# Altium schematic sheet Main.SchDoc
size A3
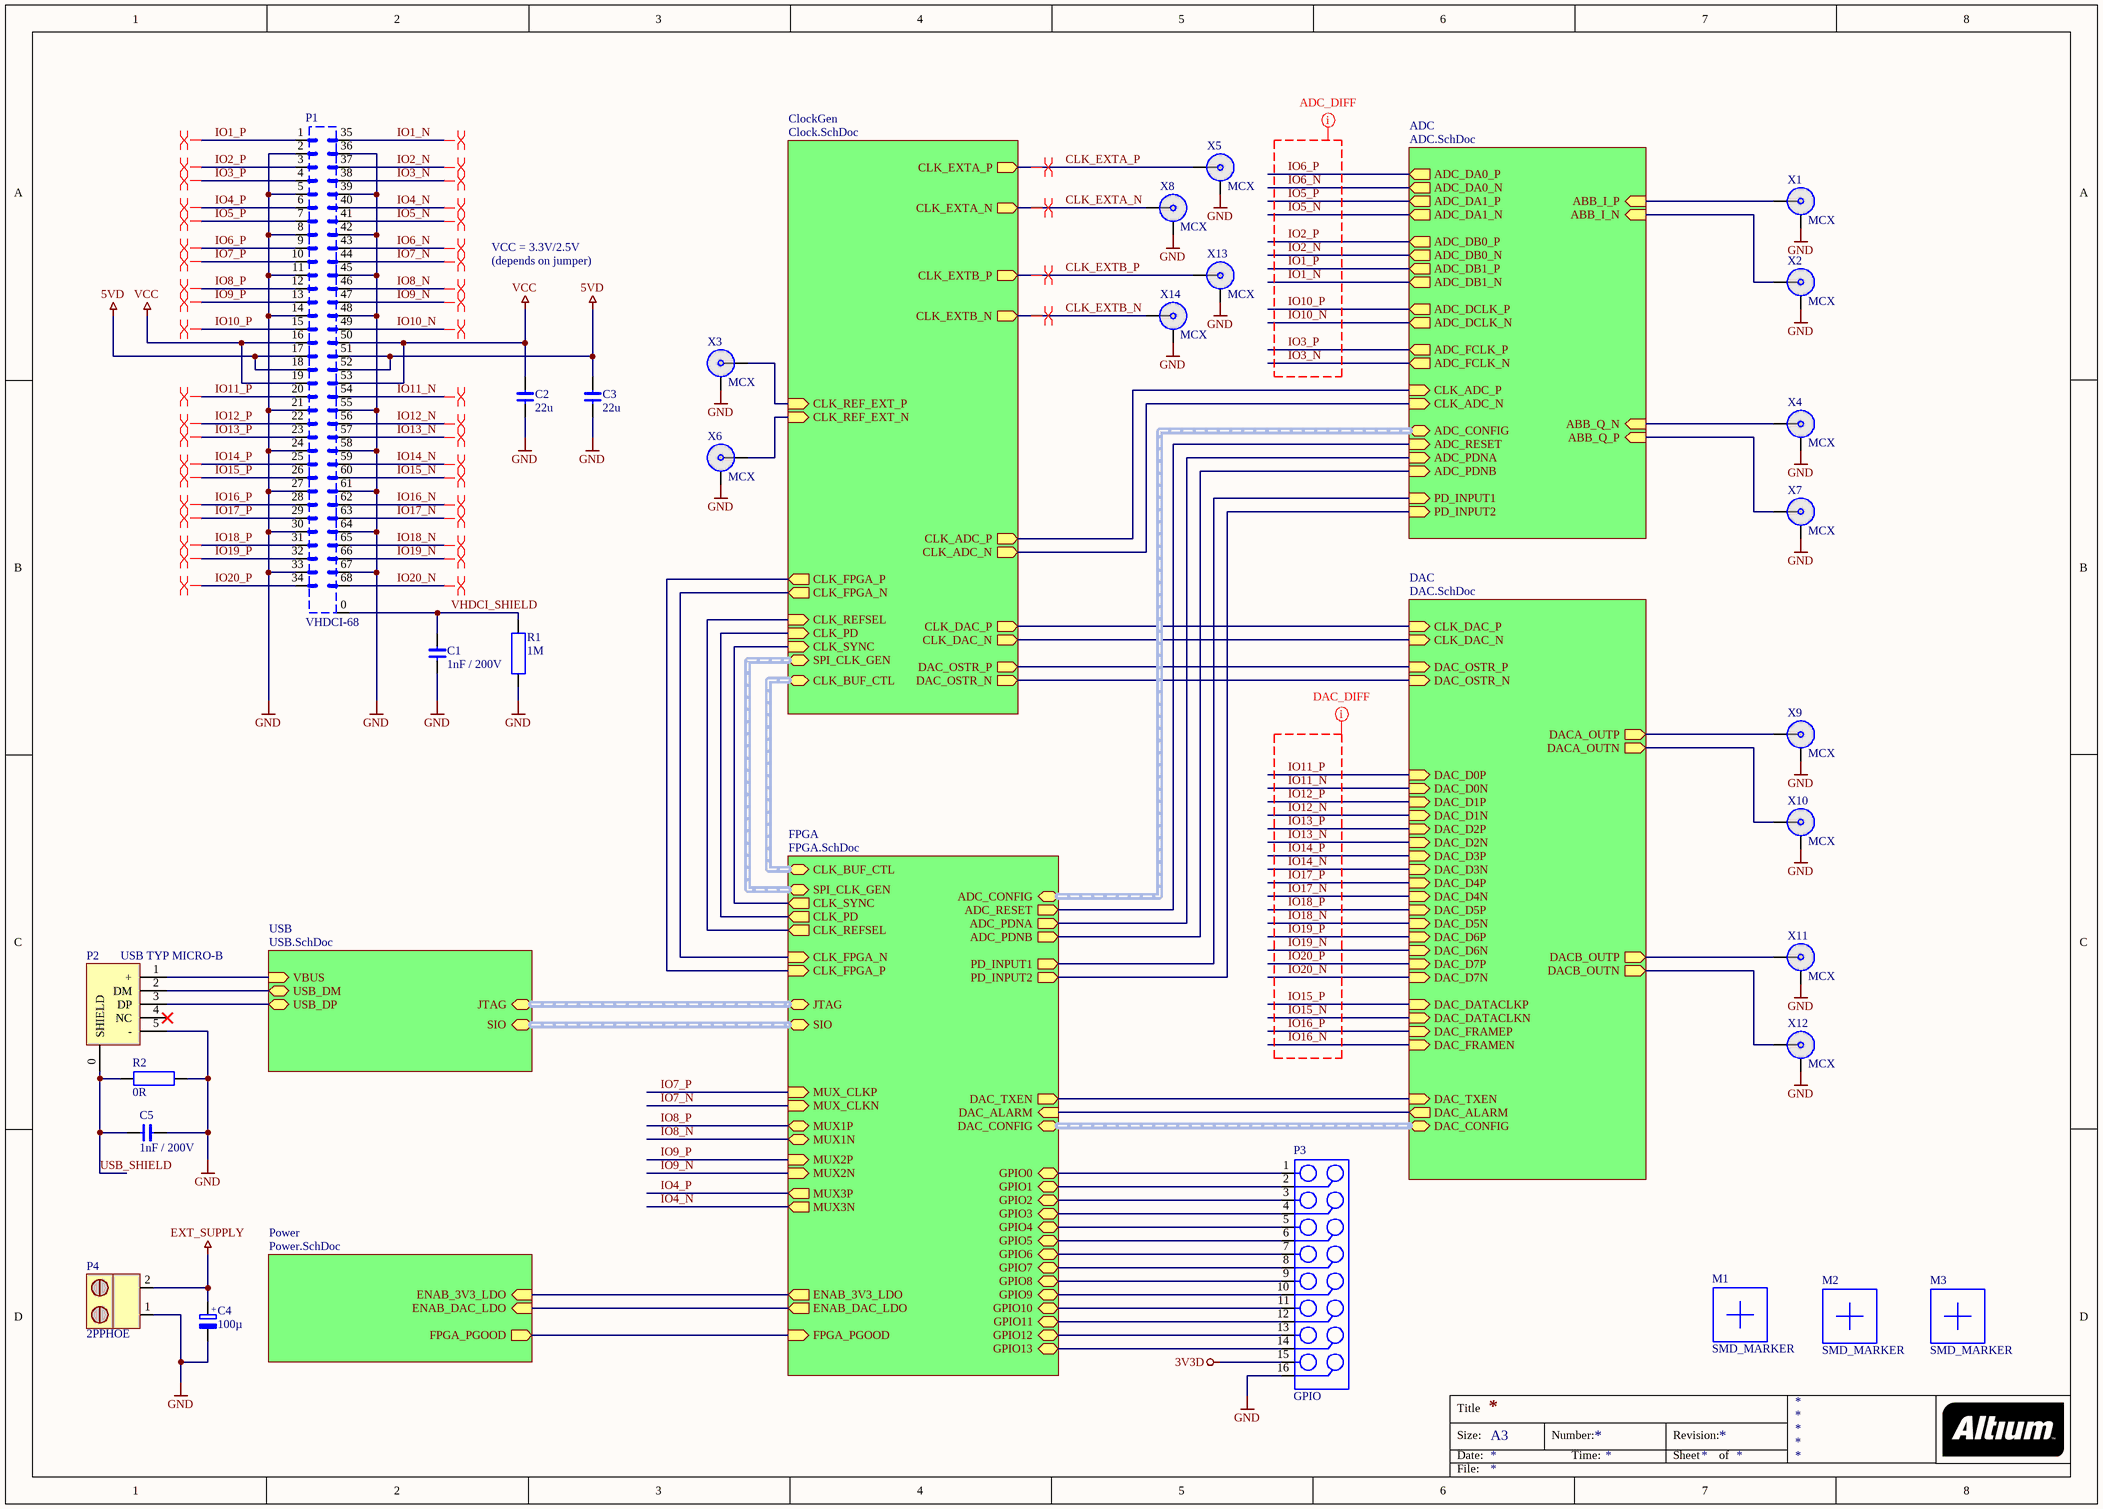
[diagram p0: Main.SchDoc]

## Parts
C1  1nF / 200V  [1206]
C2  22u  [1206]
C3  22u  [1206]
C4  100µ  [SMD_ELKO_6.3]
C5  1nF / 200V  [1206]
M1  SMD_MARKER  [SMDMark100 - nopaste]
M2  SMD_MARKER  [SMDMark100 - nopaste]
M3  SMD_MARKER  [SMDMark100 - nopaste]
P1  VHDCI-68  [VHDCI-68_M]
P2  USB TYP MICRO-B  [USB_MICRO_B_SMD_4DIP]
P3  GPIO  [16POL_PF2]
P4  2PPHOE  [2PPHOE]
R1  1M  [1206]
R2  0R  [1206]
X1  MCX  [MCX_TH]
X2  MCX  [MCX_TH]
X3  MCX  [MCX_TH]
X4  MCX  [MCX_TH]
X5  MCX  [MCX_TH]
X6  MCX  [MCX_TH]
X7  MCX  [MCX_TH]
X8  MCX  [MCX_TH]
X9  MCX  [MCX_TH]
X10  MCX  [MCX_TH]
X11  MCX  [MCX_TH]
X12  MCX  [MCX_TH]
X13  MCX  [MCX_TH]
X14  MCX  [MCX_TH]

## Sub-sheets
ADC = ADC.SchDoc: ABB_I_P (in), ABB_I_N (in), ABB_Q_N (in), ABB_Q_P (in), CLK_ADC_P (in), CLK_ADC_N (in), ADC_DA0_P (out), ADC_DA1_P (out), ADC_DB0_P (out), ADC_DB1_P (out), ADC_DCLK_P (out), ADC_FCLK_P (out), ADC_CONFIG (harness SPI3), ADC_RESET (in), ADC_PDNA (in), ADC_PDNB (in), PD_INPUT1 (in), PD_INPUT2 (in), ADC_DA0_N (out), ADC_DA1_N (out), ADC_DB0_N (out), ADC_DB1_N (out), ADC_DCLK_N (out), ADC_FCLK_N (out)
ClockGen = Clock.SchDoc: SPI_CLK_GEN (harness SPI_CLK_GEN), CLK_REFSEL (in), CLK_PD (in), CLK_SYNC (in), CLK_REF_EXT_P (in), CLK_REF_EXT_N (in), CLK_ADC_P (out), CLK_ADC_N (out), CLK_DAC_P (out), CLK_DAC_N (out), DAC_OSTR_P (out), DAC_OSTR_N (out), CLK_FPGA_P (out), CLK_FPGA_N (out), CLK_EXTB_P (out), CLK_EXTB_N (out), CLK_EXTA_P (out), CLK_EXTA_N (out), CLK_BUF_CTL (harness CLK_BUF_CTL)
DAC = DAC.SchDoc: DAC_D0P (in), DAC_D0N (in), DAC_D1P (in), DAC_D1N (in), DAC_D2P (in), DAC_D2N (in), DAC_D3P (in), DAC_D3N (in), DAC_D4P (in), DAC_D4N (in), DAC_D5P (in), DAC_D5N (in), DAC_D6N (in), DAC_D7N (in), DAC_D6P (in), DAC_D7P (in), DAC_DATACLKN (in), DAC_DATACLKP (in), DAC_FRAMEN (in), DAC_FRAMEP (in), DAC_CONFIG (harness SPI3), DAC_TXEN (in), DAC_ALARM (out), DACA_OUTP (out), DACA_OUTN (out), DACB_OUTP (out), DACB_OUTN (out), CLK_DAC_P (in), CLK_DAC_N (in), DAC_OSTR_P (in), DAC_OSTR_N (in)
FPGA = FPGA.SchDoc: JTAG (harness JTAG), SIO (harness Serial IO), ENAB_3V3_LDO (out), FPGA_PGOOD (in), DAC_CONFIG (harness SPI3), DAC_TXEN (out), DAC_ALARM (in), ADC_CONFIG (harness SPI3), ADC_RESET (out), ADC_PDNA (out), ADC_PDNB (out), MUX_CLKP (in), MUX_CLKN (in), MUX2P (in), MUX2N (in), MUX3N (out), MUX3P (out), GPIO0, GPIO1, GPIO2, GPIO3, GPIO4, GPIO5, GPIO6, GPIO7, GPIO8, GPIO9, GPIO10, GPIO11, GPIO12, GPIO13, PD_INPUT1 (out), PD_INPUT2 (out), SPI_CLK_GEN (harness SPI_CLK_GEN), CLK_REFSEL (out), CLK_PD (out), CLK_SYNC (out), CLK_FPGA_P (in), CLK_FPGA_N (in), ENAB_DAC_LDO (out), MUX1N, MUX1P, CLK_BUF_CTL (harness CLK_BUF_CTL)
Power = Power.SchDoc: ENAB_3V3_LDO (in), FPGA_PGOOD (out), ENAB_DAC_LDO (in)
USB = USB.SchDoc: USB_DP (bidir), USB_DM (bidir), JTAG (harness JTAG), SIO (harness Serial IO), VBUS (in)

## Nets
3V3D: P3.15
5VD: C3.1 P1.17 P1.18 P1.51 P1.52
EXT_SUPPLY: C4.1(+) P4.2
GND: C1.2 C2.2 C3.2 C4.2(-) C5.1 P1.2 P1.5 P1.8 P1.11 P1.14 P1.21 P1.24 P1.27 P1.30 P1.33 P1.36 P1.39 P1.42 P1.45 P1.48 P1.55 P1.58 P1.61 P1.64 P1.67 P2.5(-) P3.16 P4.1 R1.2 R2.1 X1.1 X2.1 X3.1 X4.1 X5.1 X6.1 X7.1 X8.1 X9.1 X10.1 X11.1 X12.1 X13.1 X14.1
VCC: C2.1 P1.16 P1.19 P1.50 P1.53
CLK_EXTA_N: X8.2 ; sheet ClockGen/CLK_EXTA_N
CLK_EXTA_P: X5.2 ; sheet ClockGen/CLK_EXTA_P
CLK_EXTB_N: X14.2 ; sheet ClockGen/CLK_EXTB_N
CLK_EXTB_P: X13.2 ; sheet ClockGen/CLK_EXTB_P
IO1_N: P1.35 ; sheet ADC/ADC_DB1_N
IO1_P: P1.1 ; sheet ADC/ADC_DB1_P
IO2_N: P1.37 ; sheet ADC/ADC_DB0_N
IO2_P: P1.3 ; sheet ADC/ADC_DB0_P
IO3_N: P1.38 ; sheet ADC/ADC_FCLK_N
IO3_P: P1.4 ; sheet ADC/ADC_FCLK_P
IO4_N: P1.40 ; sheet FPGA/MUX3N
IO4_P: P1.6 ; sheet FPGA/MUX3P
IO5_N: P1.41 ; sheet ADC/ADC_DA1_N
IO5_P: P1.7 ; sheet ADC/ADC_DA1_P
IO6_N: P1.43 ; sheet ADC/ADC_DA0_N
IO6_P: P1.9 ; sheet ADC/ADC_DA0_P
IO7_N: P1.44 ; sheet FPGA/MUX_CLKN
IO7_P: P1.10 ; sheet FPGA/MUX_CLKP
IO8_N: P1.46 ; sheet FPGA/MUX1N
IO8_P: P1.12 ; sheet FPGA/MUX1P
IO9_N: P1.47 ; sheet FPGA/MUX2N
IO9_P: P1.13 ; sheet FPGA/MUX2P
IO10_N: P1.49 ; sheet ADC/ADC_DCLK_N
IO10_P: P1.15 ; sheet ADC/ADC_DCLK_P
IO11_N: P1.54 ; sheet DAC/DAC_D0N
IO11_P: P1.20 ; sheet DAC/DAC_D0P
IO12_N: P1.56 ; sheet DAC/DAC_D1N
IO12_P: P1.22 ; sheet DAC/DAC_D1P
IO13_N: P1.57 ; sheet DAC/DAC_D2N
IO13_P: P1.23 ; sheet DAC/DAC_D2P
IO14_N: P1.59 ; sheet DAC/DAC_D3N
IO14_P: P1.25 ; sheet DAC/DAC_D3P
IO15_N: P1.60 ; sheet DAC/DAC_DATACLKN
IO15_P: P1.26 ; sheet DAC/DAC_DATACLKP
IO16_N: P1.62 ; sheet DAC/DAC_FRAMEN
IO16_P: P1.28 ; sheet DAC/DAC_FRAMEP
IO17_N: P1.63 ; sheet DAC/DAC_D4N
IO17_P: P1.29 ; sheet DAC/DAC_D4P
IO18_N: P1.65 ; sheet DAC/DAC_D5N
IO18_P: P1.31 ; sheet DAC/DAC_D5P
IO19_N: P1.66 ; sheet DAC/DAC_D6N
IO19_P: P1.32 ; sheet DAC/DAC_D6P
IO20_N: P1.68 ; sheet DAC/DAC_D7N
IO20_P: P1.34 ; sheet DAC/DAC_D7P
USB_SHIELD: C5.2 P2.0(SHIELD) R2.2
VHDCI_SHIELD: C1.1 P1.0(SHIELD) R1.1
NetP2_1: P2.1(+) ; sheet USB/VBUS
NetP2_2: P2.2(DM) ; sheet USB/USB_DM
NetP2_3: P2.3(DP) ; sheet USB/USB_DP
NetP3_1: P3.1 ; sheet FPGA/GPIO0
NetP3_2: P3.2 ; sheet FPGA/GPIO1
NetP3_3: P3.3 ; sheet FPGA/GPIO2
NetP3_4: P3.4 ; sheet FPGA/GPIO3
NetP3_5: P3.5 ; sheet FPGA/GPIO4
NetP3_6: P3.6 ; sheet FPGA/GPIO5
NetP3_7: P3.7 ; sheet FPGA/GPIO6
NetP3_8: P3.8 ; sheet FPGA/GPIO7
NetP3_9: P3.9 ; sheet FPGA/GPIO8
NetP3_10: P3.10 ; sheet FPGA/GPIO9
NetP3_11: P3.11 ; sheet FPGA/GPIO10
NetP3_12: P3.12 ; sheet FPGA/GPIO11
NetP3_13: P3.13 ; sheet FPGA/GPIO12
NetP3_14: P3.14 ; sheet FPGA/GPIO13
NetX1_2: X1.2 ; sheet ADC/ABB_I_P
NetX2_2: X2.2 ; sheet ADC/ABB_I_N
NetX3_2: X3.2 ; sheet ClockGen/CLK_REF_EXT_P
NetX4_2: X4.2 ; sheet ADC/ABB_Q_N
NetX6_2: X6.2 ; sheet ClockGen/CLK_REF_EXT_N
NetX7_2: X7.2 ; sheet ADC/ABB_Q_P
NetX9_2: X9.2 ; sheet DAC/DACA_OUTP
NetX10_2: X10.2 ; sheet DAC/DACA_OUTN
NetX11_2: X11.2 ; sheet DAC/DACB_OUTP
NetX12_2: X12.2 ; sheet DAC/DACB_OUTN
(unnamed): sheet ADC/CLK_ADC_P, sheet ClockGen/CLK_ADC_P
(unnamed): sheet ADC/CLK_ADC_N, sheet ClockGen/CLK_ADC_N
(unnamed): sheet ADC/ADC_RESET, sheet FPGA/ADC_RESET
(unnamed): sheet ADC/ADC_PDNA, sheet FPGA/ADC_PDNA
(unnamed): sheet ADC/ADC_PDNB, sheet FPGA/ADC_PDNB
(unnamed): sheet ADC/PD_INPUT1, sheet FPGA/PD_INPUT1
(unnamed): sheet ADC/PD_INPUT2, sheet FPGA/PD_INPUT2
(unnamed): sheet DAC/DAC_TXEN, sheet FPGA/DAC_TXEN
(unnamed): sheet DAC/DAC_ALARM, sheet FPGA/DAC_ALARM
(unnamed): sheet DAC/CLK_DAC_P, sheet ClockGen/CLK_DAC_P
(unnamed): sheet DAC/CLK_DAC_N, sheet ClockGen/CLK_DAC_N
(unnamed): sheet DAC/DAC_OSTR_P, sheet ClockGen/DAC_OSTR_P
(unnamed): sheet DAC/DAC_OSTR_N, sheet ClockGen/DAC_OSTR_N
(unnamed): sheet FPGA/ENAB_3V3_LDO, sheet Power/ENAB_3V3_LDO
(unnamed): sheet FPGA/FPGA_PGOOD, sheet Power/FPGA_PGOOD
(unnamed): sheet FPGA/CLK_REFSEL, sheet ClockGen/CLK_REFSEL
(unnamed): sheet FPGA/CLK_PD, sheet ClockGen/CLK_PD
(unnamed): sheet FPGA/CLK_SYNC, sheet ClockGen/CLK_SYNC
(unnamed): sheet FPGA/CLK_FPGA_P, sheet ClockGen/CLK_FPGA_P
(unnamed): sheet FPGA/CLK_FPGA_N, sheet ClockGen/CLK_FPGA_N
(unnamed): sheet FPGA/ENAB_DAC_LDO, sheet Power/ENAB_DAC_LDO

Not connected (* = marked no-connect by the designer): P2 4(NC)*

## Buses and harness runs
harness sheet ADC/ADC_CONFIG = sheet FPGA/ADC_CONFIG
harness sheet ClockGen/CLK_BUF_CTL = sheet FPGA/CLK_BUF_CTL
harness sheet ClockGen/SPI_CLK_GEN = sheet FPGA/SPI_CLK_GEN
harness sheet DAC/DAC_CONFIG = sheet FPGA/DAC_CONFIG
harness sheet FPGA/JTAG = sheet USB/JTAG
harness sheet FPGA/SIO = sheet USB/SIO

## Layout directives
differential pair: CLK_EXTA_N, CLK_EXTA_P, CLK_EXTB_N, CLK_EXTB_P, IO1_N, IO1_P, IO2_N, IO2_P, IO3_N, IO3_P, IO4_N, IO4_P, IO5_N, IO5_P, IO6_N, IO6_P, IO7_N, IO7_P, IO8_N, IO8_P, IO9_N, IO9_P, IO10_N, IO10_P, IO11_N, IO11_P, IO12_N, IO12_P, IO13_N, IO13_P, IO14_N, IO14_P, IO15_N, IO15_P, IO16_N, IO16_P, IO17_N, IO17_P, IO18_N, IO18_P, IO19_N, IO19_P, IO20_N, IO20_P
net class DAC_DIFF: IO11_N, IO11_P, IO12_N, IO12_P, IO13_N, IO13_P, IO14_N, IO14_P, IO15_N, IO15_P, IO16_N, IO16_P, IO17_N, IO17_P, IO18_N, IO18_P, IO19_N, IO19_P, IO20_N, IO20_P
net class ADC_DIFF: IO1_N, IO1_P, IO2_N, IO2_P, IO3_N, IO3_P, IO5_N, IO5_P, IO6_N, IO6_P, IO10_N, IO10_P

## Notes on the sheet
- VCC = 3.3V/2.5V
- (depends on jumper)
- Title
- Size:
- Date:
- A3
- Number:
- Time:
- Revision:
- Sheet
- of
- File:

## Library data of the parts
C1-C3 C5 = C
C4 = ELCO: EEH-ZA1E101XP
M1-M3 = SMD_MARKER: SMD MARKER
P1 = MALE_VHDCI-68: 68-Pin VHDCI Connector
P2 = USB TYP MICRO-B: 10118194-0001LF
P3 = 16POLPF
P4 = 2PPHOE: Steckbare Scharubklemme 2pol.
R1 R2 = R
X1-X14 = MCX: MCX Connector